# EAGLE design cap_mother_v1.0 (EAGLE 9.5.1)
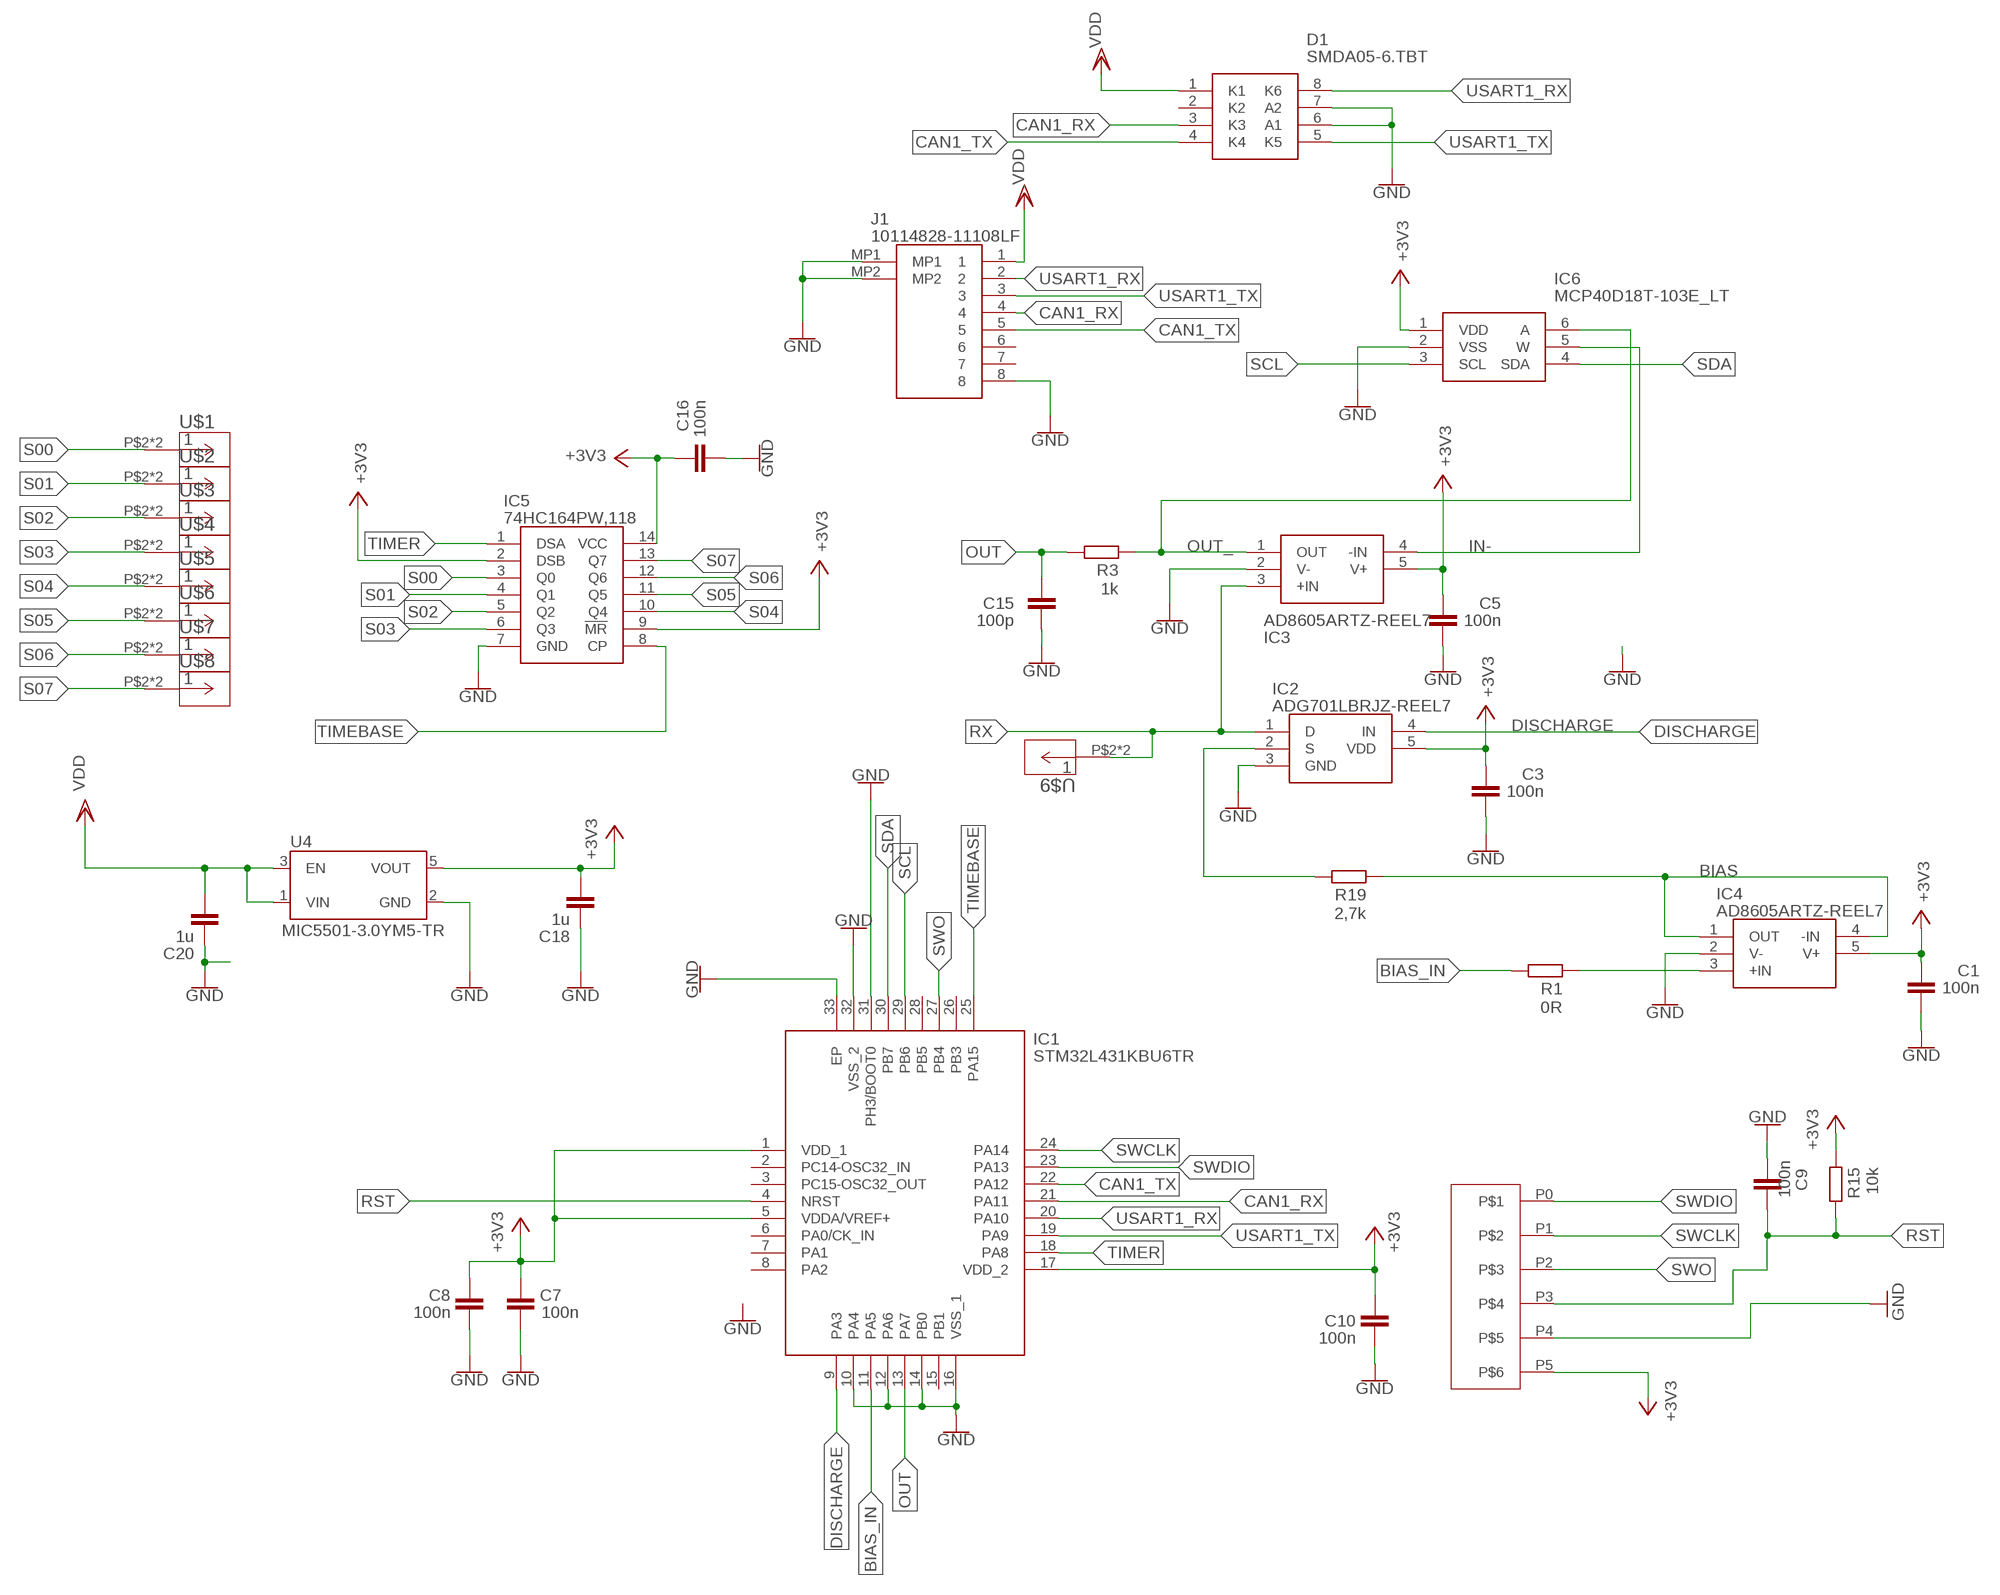
[diagram p0: schematic, sheet 1]

## Parts
C1  100n  C-EUC0603K  [C0603K]
C3  100n  C-EUC0603K  [C0603K]
C5  100n  C-EUC0603K  [C0603K]
C7  100n  C-EUC0603K  [C0603K]
C8  100n  C-EUC0603K  [C0603K]
C9  100n  C-EUC0603  [C0603]
C10  100n  C-EUC0603K  [C0603K]
C15  100p  C-EUC0603  [C0603]
C16  100n  C-EUC0603K  [C0603K]
C18  1u  C-EUC0603K  [C0603K]
C20  1u  C-EUC0603  [C0603]
D1  SMDA05-6.TBT  [SOIC127P600X175-8N]
IC1  STM32L431KBU6TR  [QFN50P500X500X60-33N]
IC2  ADG701LBRJZ-REEL7  [SOT95P280X145-5N]
IC3  AD8605ARTZ-REEL7  [SOT95P280X145-5N]
IC4  AD8605ARTZ-REEL7  [SOT95P280X145-5N]
IC5  74HC164PW,118  [SOP65P640X110-14N]
IC6  MCP40D18T-103E_LT  [SOT65P210X110-6N]
J1  10114828-11108LF  [1011482811108LF]
R1  0R  R-EU_R0603  [R0603]
R3  1k  R-EU_R0603  [R0603]
R15  10k  R-EU_R0603  [R0603]
R19  2,7k  R-EU_R0603  [R0603]
U4  MIC5501-3.0YM5-TR  [SOT95P280X145-5N]
U$1  CAST_HOLE_1X1SHORT  [CASTELATED_HOLE_SHORT]
U$2  CAST_HOLE_1X1SHORT  [CASTELATED_HOLE_SHORT]
U$3  CAST_HOLE_1X1SHORT  [CASTELATED_HOLE_SHORT]
U$4  CAST_HOLE_1X1SHORT  [CASTELATED_HOLE_SHORT]
U$5  CAST_HOLE_1X1SHORT  [CASTELATED_HOLE_SHORT]
U$6  CAST_HOLE_1X1SHORT  [CASTELATED_HOLE_SHORT]
U$7  CAST_HOLE_1X1SHORT  [CASTELATED_HOLE_SHORT]
U$8  CAST_HOLE_1X1SHORT  [CASTELATED_HOLE_SHORT]
U$9  CAST_HOLE_1X1SHORT  [CASTELATED_HOLE_SHORT]
U$10  SMD_SWO  [SWD_SMD]

## Nets
+3V3: C1.2 C3.2 C5.2 C7.2 C8.2 C10.2 C16.2 C18.2 IC1.1(VDD_1) IC1.5(VDDA/VREF+) IC1.17(VDD_2) IC2.5(VDD) IC3.5(V+) IC4.5(V+) IC5.2(DSB) IC5.9(!MR) IC5.14(VCC) IC6.1(VDD) R15.1 U4.5(VOUT) U$10.P5
BIAS: IC4.1(OUT) IC4.4(-IN) R19.1
BIAS_IN: IC1.11(PA5) R1.2
CAN1_RX: D1.3(K3) IC1.21(PA11) J1.4
CAN1_TX: D1.4(K4) IC1.22(PA12) J1.5
DISCHARGE: IC1.9(PA3) IC2.4(IN)
GND: C1.1 C3.1 C5.1 C7.1 C8.1 C9.1 C10.1 C15.1 C16.1 C18.1 C20.1 D1.6(A1) D1.7(A2) IC1.10(PA4) IC1.12(PA6) IC1.14(PB0) IC1.16(VSS_1) IC1.31(PH3/BOOT0) IC1.32(VSS_2) IC1.33(EP) IC2.3(GND) IC3.2(V-) IC4.2(V-) IC5.7(GND) IC6.2(VSS) J1.8 J1.MP1 J1.MP2 U4.2(GND) U$10.P4
IN-: IC3.4(-IN) IC6.5(W)
N$1: IC4.3(+IN) R1.1
OUT: C15.2 IC1.13(PA7) R3.2
OUT_: IC3.1(OUT) IC6.6(A) R3.1
RST: C9.2 IC1.4(NRST) R15.2 U$10.P3
RX [RX]: IC2.1(D) IC3.3(+IN) U$9.P$2 U$9.P$3
S: IC2.2(S) R19.2
S00: IC5.3(Q0) U$1.P$2 U$1.P$3
S01: IC5.4(Q1) U$2.P$2 U$2.P$3
S02: IC5.5(Q2) U$3.P$2 U$3.P$3
S03: IC5.6(Q3) U$4.P$2 U$4.P$3
S04: IC5.10(Q4) U$5.P$2 U$5.P$3
S05: IC5.11(Q5) U$6.P$2 U$6.P$3
S06: IC5.12(Q6) U$7.P$2 U$7.P$3
S07: IC5.13(Q7) U$8.P$2 U$8.P$3
SCL: IC1.29(PB6) IC6.3(SCL)
SDA: IC1.30(PB7) IC6.4(SDA)
SWCLK: IC1.24(PA14) U$10.P1
SWDIO: IC1.23(PA13) U$10.P0
SWO: IC1.27(PB4) U$10.P2
TIMEBASE: IC1.25(PA15) IC5.8(CP)
TIMER: IC1.18(PA8) IC5.1(DSA)
USART1_RX: D1.8(K6) IC1.20(PA10) J1.2
USART1_TX: D1.5(K5) IC1.19(PA9) J1.3
VDD: C20.2 D1.1(K1) J1.1 U4.1(VIN) U4.3(EN)
Unconnected: D1.2(K2) IC1.2(PC14-OSC32_IN) IC1.3(PC15-OSC32_OUT) IC1.6(PA0/CK_IN) IC1.7(PA1) IC1.8(PA2) IC1.15(PB1) IC1.26(PB3) IC1.28(PB5) J1.6 J1.7

## Library data of the parts
C1 C3 C5 C7-C10 C15 C16 C18 C20 = rcl:C-EU: CAPACITOR, European symbol; SPICEPREFIX: C
D1 = SamacSys_Parts:SMDA05-6.TBT: Semtech SMDA05-6.TBT, Hex-Element Uni-Directional TVS Diode Array, 300W, 8-Pin SOIC Source: Datasheet <https://datasheet.datasheetarchive.com/originals/distributors/DKDS-37/728677.pdf>; DESCRIPTION: Semtech SMDA05-6.TBT, Hex-Element Uni-Directional TVS Diode Array, 300W, 8-Pin SOIC; HEIGHT: 1.75mm; MANUFACTURER_NAME: SEMTECH; MANUFACTURER_PART_NUMBER: SMDA05-6.TBT; MOUSER_PART_NUMBER: 947-SMDA05-6.TBT; MOUSER_PRICE-STOCK: https://www.mouser.co.uk/ProductDetail/Semtech/SMDA05-6TBT/?qs=rBWM4%252BvDhIeV9BDKWI3yYQ%3D%3D
IC1 = SamacSys_Parts:STM32L431KBU6TR: ARM Microcontrollers - MCU Ultra-low-power with FPU ARM Cortex-M4 MCU 80 MHz with 128 Kbytes Flash Source: Datasheet <http://www.st.com/content/ccc/resource/technical/document/datasheet/group3/83/b3/60/f6/b1/cc/47/7e/DM00257211/files/DM00257211.pdf/jcr:content/translations/en.DM00257211.pdf>; DESCRIPTION: ARM Microcontrollers - MCU Ultra-low-power with FPU ARM Cortex-M4 MCU 80 MHz with 128 Kbytes Flash; HEIGHT: 0.6mm; MANUFACTURER_NAME: STMicroelectronics; MANUFACTURER_PART_NUMBER: STM32L431KBU6TR; MOUSER_PART_NUMBER: 511-STM32L431KBU6TR; MOUSER_PRICE-STOCK: https://www.mouser.co.uk/ProductDetail/STMicroelectronics/STM32L431KBU6TR?qs=W0yvOO0ixfE2EtLQW2K77Q%3D%3D
IC2 = SamacSys_Parts:ADG701LBRJZ-REEL7: Analog Switch ICs Low Voltage SPDT IC with Low Leakage Source: Datasheet <https://www.analog.com/media/en/technical-documentation/data-sheets/adg701l_702l.pdf>; DESCRIPTION: Analog Switch ICs Low Voltage SPDT IC with Low Leakage; HEIGHT: 1.45mm; MANUFACTURER_NAME: Analog Devices; MANUFACTURER_PART_NUMBER: ADG701LBRJZ-REEL7; MOUSER_PART_NUMBER: 584-ADG701LBRJZ-R7; MOUSER_PRICE-STOCK: https://www.mouser.co.uk/ProductDetail/Analog-Devices/ADG701LBRJZ-REEL7?qs=BpaRKvA4VqGa%2F05Rk2gYkw%3D%3D
IC3 IC4 = SamacSys_Parts:AD8605ARTZ-REEL7: Operational Amplifiers Source: Datasheet; DESCRIPTION: Operational Amplifiers; HEIGHT: 1.45mm; MANUFACTURER_NAME: Analog Devices; MANUFACTURER_PART_NUMBER: AD8605ARTZ-REEL7; MOUSER_PART_NUMBER: 584-AD8605ARTZ-R7; MOUSER_PRICE-STOCK: https://www.mouser.co.uk/ProductDetail/Analog-Devices/AD8605ARTZ-REEL7?qs=%2FtpEQrCGXCy1BQTrX2ofig%3D%3D
IC5 = SamacSys_Parts:74HC164PW,118: 74HC(T)164 - 8-bit serial-in, parallel-out shift register@en-us Source: Datasheet <https://assets.nexperia.com/documents/data-sheet/74HC_HCT164.pdf>; DESCRIPTION: 74HC(T)164 - 8-bit serial-in, parallel-out shift register@en-us; HEIGHT: 1.1mm; MANUFACTURER_NAME: Nexperia; MANUFACTURER_PART_NUMBER: 74HC164PW,118; MOUSER_PART_NUMBER: 771-74HC164PW-T; MOUSER_PRICE-STOCK: https://www.mouser.co.uk/ProductDetail/Nexperia/74HC164PW118?qs=P62ublwmbi9iFqSookzqlw%3D%3D
IC6 = SamacSys_Parts:MCP40D18T-103E_LT: Digital Potentiometer, 10k, 7-bit, I2C Source: Datasheet <http://ww1.microchip.com/downloads/en/DeviceDoc/22152b.pdf>; DESCRIPTION: Digital Potentiometer, 10k, 7-bit, I2C; HEIGHT: 1.1mm; MANUFACTURER_NAME: Microchip; MANUFACTURER_PART_NUMBER: MCP40D18T-103E/LT; MOUSER_PART_NUMBER: 579-MCP40D18T103E/LT; MOUSER_PRICE-STOCK: https://www.mouser.co.uk/ProductDetail/Microchip-Technology/MCP40D18T-103E-LT?qs=dQMF8gqycOXln2h%252BoShOLQ%3D%3D
J1 = SamacSys_Parts:10114828-11108LF: 1.25mm Wire to Board Wafer,Vertical, Surface Mount, 8 Positions Source: Datasheet <https://cdn.amphenol-cs.com/media/wysiwyg/files/drawing/10114828.pdf>; DESCRIPTION: 1.25mm Wire to Board Wafer,Vertical, Surface Mount, 8 Positions; HEIGHT: 5.2mm; MANUFACTURER_NAME: Amphenol Communications Solutions; MANUFACTURER_PART_NUMBER: 10114828-11108LF; MOUSER_PART_NUMBER: 649-10114828-11108LF; MOUSER_PRICE-STOCK: https://www.mouser.co.uk/ProductDetail/Amphenol-FCI/10114828-11108LF?qs=SqJKR5MmryfFoElmUQ%252BV5w%3D%3D
R1 R3 R15 R19 = rcl:R-EU_: RESISTOR, European symbol; SPICEPREFIX: R
U4 = LDO:MIC5501-3.0YM5-TR: General Purpose Single 300mA LDO, 5 SOT-23 T/R Check prices <https://pricing.snapeda.com/parts/MIC5501-3.0YM5-TR/Microchip/view-part?ref=eda>; AVAILABILITY: In Stock; DESCRIPTION: Linear Voltage Regulator IC Positive Fixed 1 Output 300mA SOT-23-5; MF: Microchip; MP: MIC5501-3.0YM5-TR; PACKAGE: SOT-23 Microchip; PRICE: None; PURCHASE-URL: https://pricing.snapeda.com/search/part/MIC5501-3.0YM5-TR/?ref=eda
U$1-U$9 = connectors:CAST_HOLE_1X1
U$10 = connectors:SMD_SWO

## Net classes
0 default: width 0.152 mm, clearance 0.203 mm
2 distance: width 0.152 mm, clearance 0.4 mm
3 RX: clearance 0.8 mm to class 0, clearance 0.8 mm
4 VDD: width 0.4 mm, clearance 0.3 mm to class 0, clearance 2 mm to class 3, clearance 0.3 mm

## Board
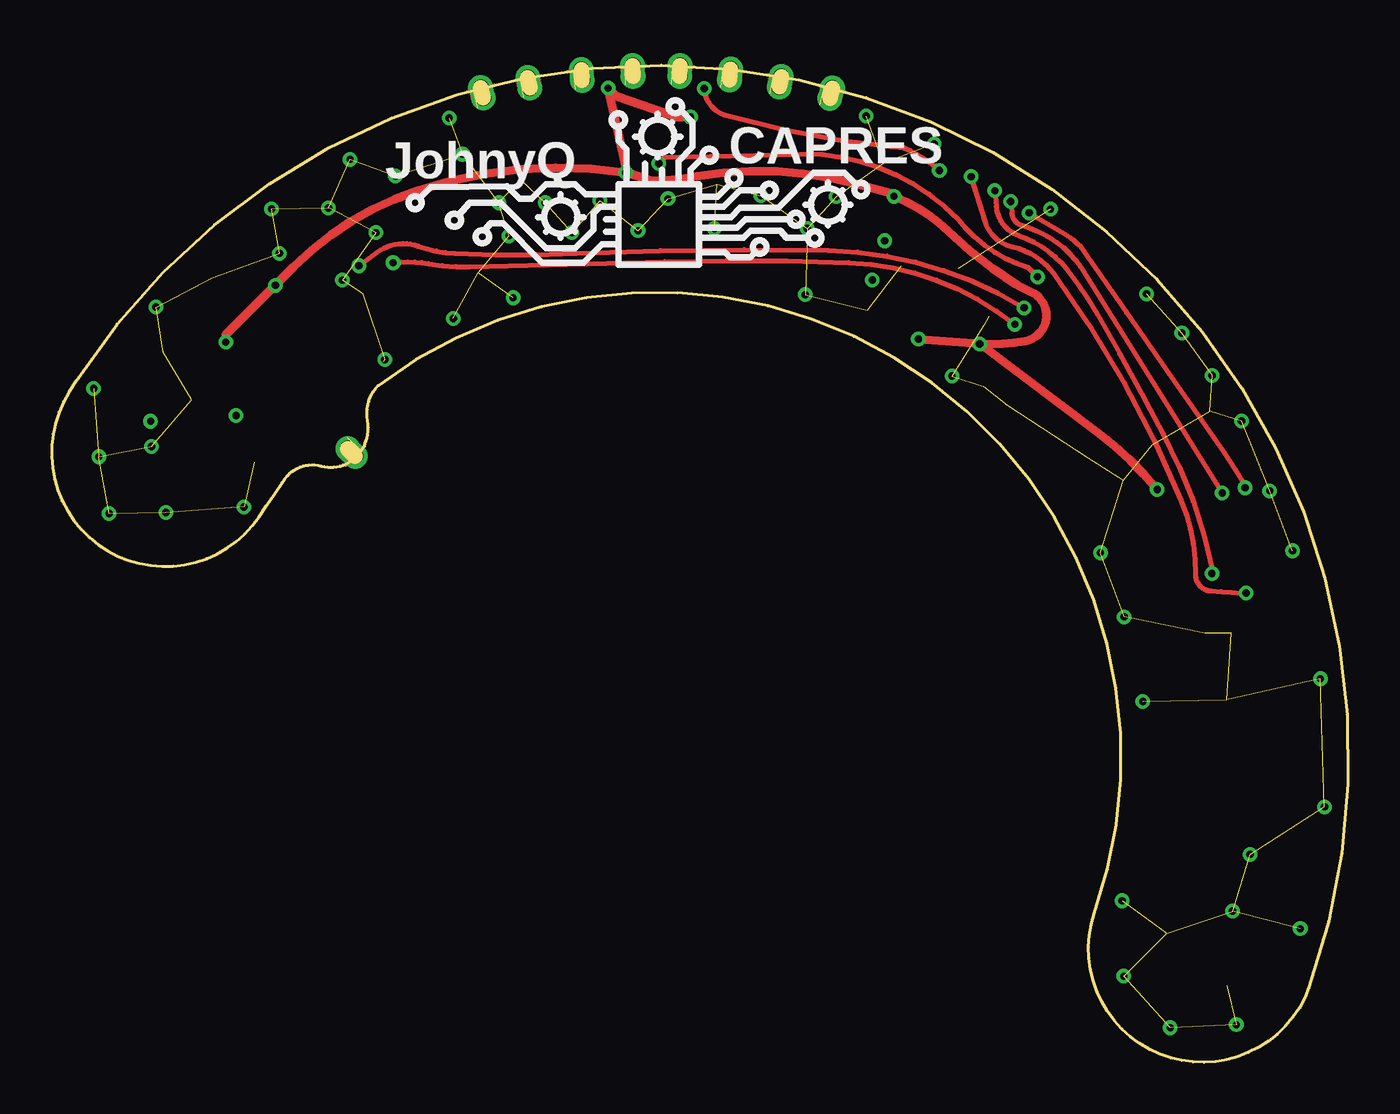
[diagram p1: board, top side]
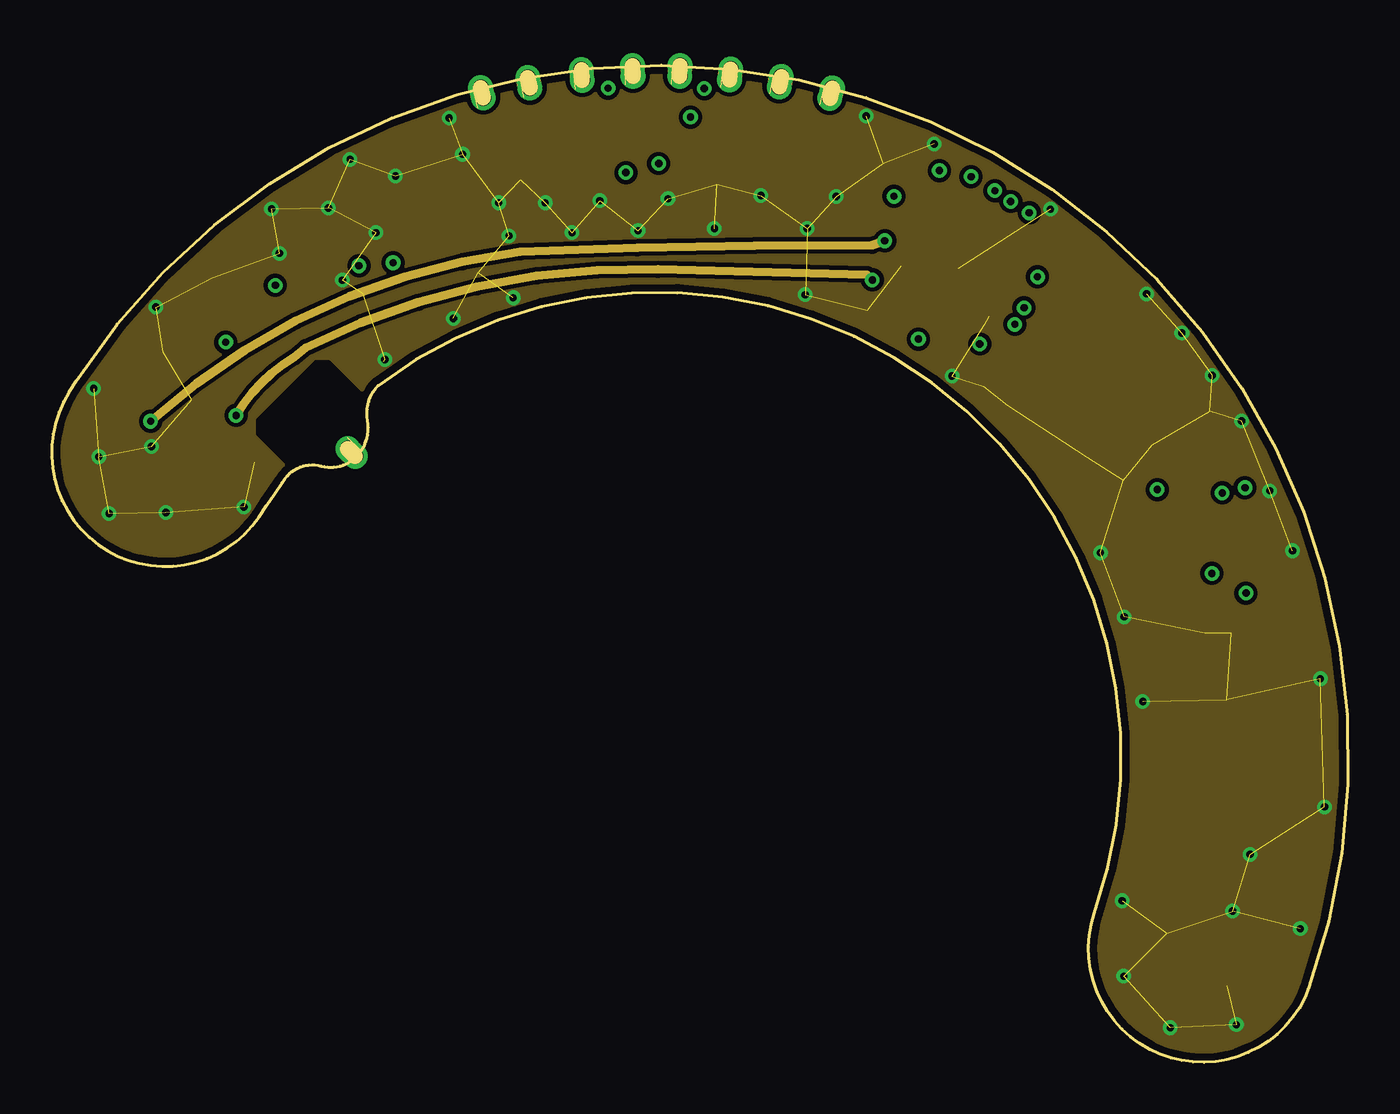
[diagram p2: board, inner layer Route2]
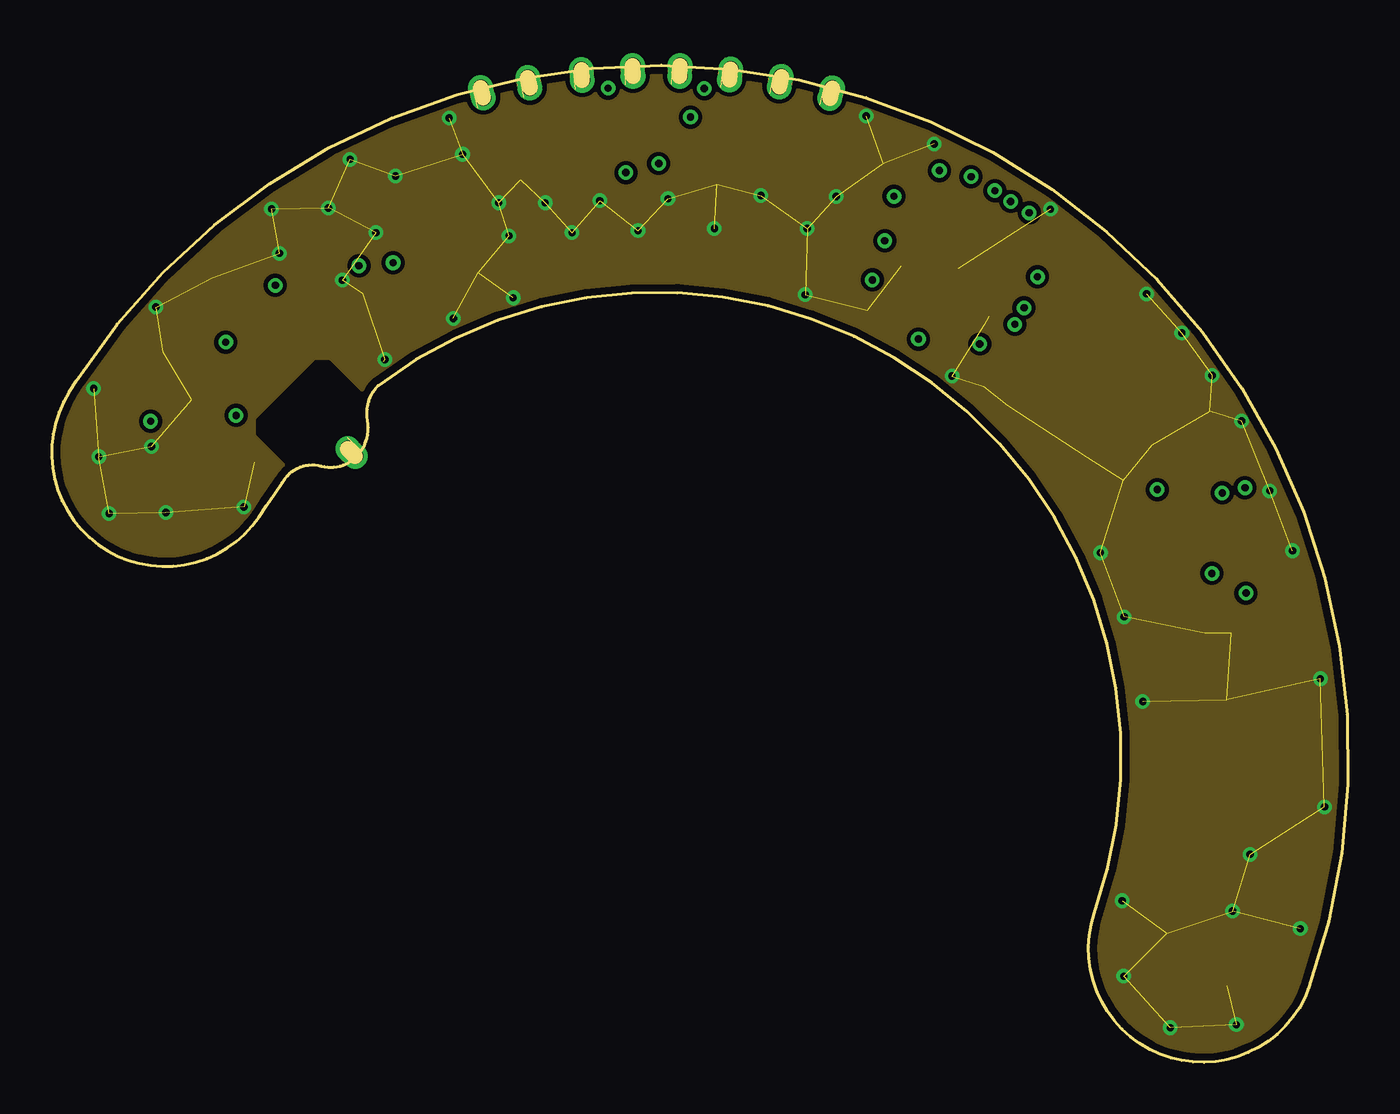
[diagram p3: board, inner layer Route15]
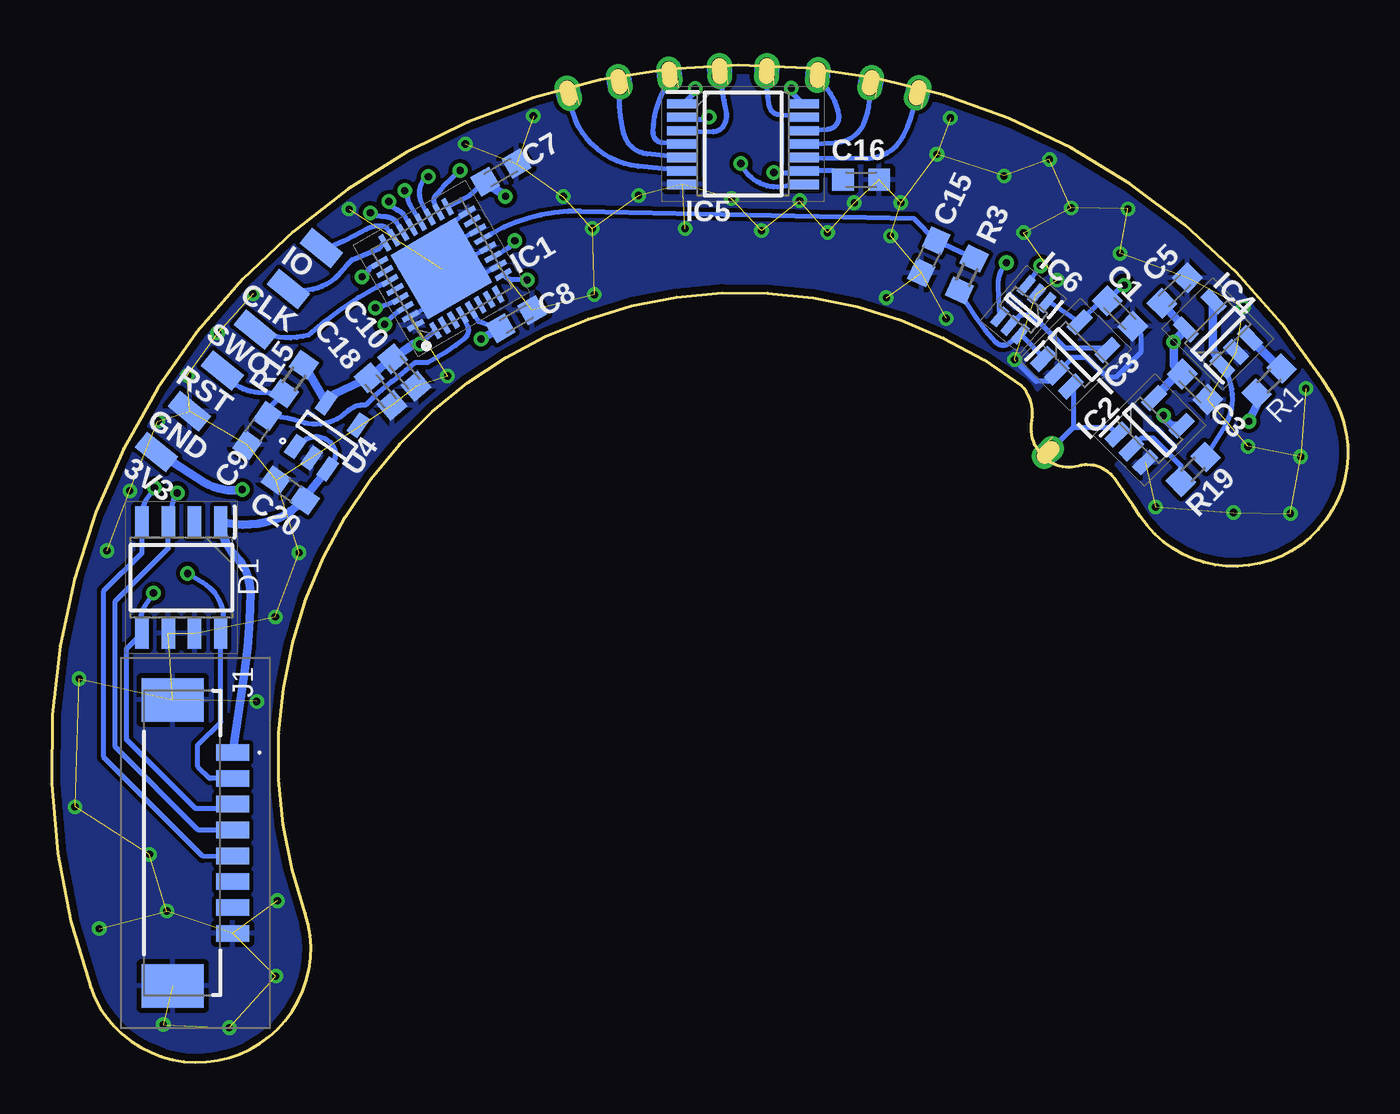
[diagram p4: board, bottom side, seen from below]

Size 62.79 x 48.28 mm. Coordinates in mm from the lower left corner, seen from the top.
Outline: 11.16,28.07 11.31,28.27 arc-68 13.06,28.87 arc60 14.76,29.32 arc55 15.31,31.07 arc-53 15.81,32.77 arc-146 50.51,7.22 arc178 60.91,3.62 arc166 1.21,33.02 0.86,32.47 arc178 10.06,26.42 arc1 11.16,28.07
Copper layers (1+2*15+16): Top 0.035559375mm / dielectric 0.47751875mm / Route2 0.035559375mm / dielectric 0.47751875mm / Route15 0.035559375mm / dielectric 0.47751875mm / Bottom 0.035559375mm
Design rules "SparkFun-4-Layer-General-JLCPCB *": minimum track width 7mil, minimum drill 12mil, track to track 0.2mm, track to pad 0.2mm, pad to pad 0.15mm, via to via 0.2mm, smd to smd 0.15mm, copper to edge 0.35mm, drill to drill 7mil, minimum pad ring 7mil, minimum via ring 7mil, stop-mask expansion 3mil, vias tented up to drill 25mil, thermal gap 10mil

### Footprints (pad centres in the part's own frame; a part is rotated, then mirrored left to right if it is on the bottom)
C0603K = smd 1.05 x 1.08: 1 -0.875,0; 2 0.875,0
C0603 = smd 1.1 x 1: 1 -0.85,0; 2 0.85,0
SOIC127P600X175-8N = smd 1.5 x 0.65: 1 -2.7,1.905; 2 -2.7,0.635; 3 -2.7,-0.635; 4 -2.7,-1.905; 5 2.7,-1.905; 6 2.7,-0.635; 7 2.7,0.635; 8 2.7,1.905
QFN50P500X500X60-33N = smd 0.85 x 0.25: 1 -2.45,1.75; 2 -2.45,1.25; 3 -2.45,0.75; 4 -2.45,0.25; 5 -2.45,-0.25; 6 -2.45,-0.75; 7 -2.45,-1.25; 8 -2.45,-1.75; 17 2.45,-1.75; 18 2.45,-1.25; 19 2.45,-0.75; 20 2.45,-0.25; 21 2.45,0.25; 22 2.45,0.75; 23 2.45,1.25; 24 2.45,1.75 | smd 0.25 x 0.85: 9 -1.75,-2.45; 10 -1.25,-2.45; 11 -0.75,-2.45; 12 -0.25,-2.45; 13 0.25,-2.45; 14 0.75,-2.45; 15 1.25,-2.45; 16 1.75,-2.45; 25 1.75,2.45; 26 1.25,2.45; 27 0.75,2.45; 28 0.25,2.45; 29 -0.25,2.45; 30 -0.75,2.45; 31 -1.25,2.45; 32 -1.75,2.45 | smd 3.6 x 3.6: 33 0,0
SOT95P280X145-5N = smd 1.2 x 0.6: 1 -1.25,0.95; 2 -1.25,0; 3 -1.25,-0.95; 4 1.25,-0.95; 5 1.25,0.95
SOP65P640X110-14N = smd 1.475 x 0.45: 1 -2.938,1.95; 2 -2.938,1.3; 3 -2.938,0.65; 4 -2.938,0; 5 -2.938,-0.65; 6 -2.938,-1.3; 7 -2.938,-1.95; 8 2.938,-1.95; 9 2.938,-1.3; 10 2.938,-0.65; 11 2.938,0; 12 2.938,0.65; 13 2.938,1.3; 14 2.938,1.95
SOT65P210X110-6N = smd 1 x 0.4: 1 -1,0.65; 2 -1,0; 3 -1,-0.65; 4 1,-0.65; 5 1,0; 6 1,0.65
1011482811108LF = smd 0.8 x 1.6: 1 -4.375,2.15; 2 -3.125,2.15; 3 -1.875,2.15; 4 -0.625,2.15; 5 0.625,2.15; 6 1.875,2.15; 7 3.125,2.15; 8 4.375,2.15 | smd 2.1 x 3: MP1 -6.925,-0.75; MP2 6.925,-0.75
R0603 = smd 1 x 1.1: 1 -0.85,0; 2 0.85,0
SOT95P280X145-5N' = smd 1.1 x 0.6: 1 -1.3,0.95; 2 -1.3,0; 3 -1.3,-0.95; 4 1.3,-0.95; 5 1.3,0.95
CASTELATED_HOLE_SHORT = drill 0.75 pad 1.2: P$2 0,-1.1; P$3 0,-1.61
SWD_SMD = smd 1.93 x 0.965: P0 0,0; P1 0,-2.54; P2 0,-5.08; P3 0,-7.62; P4 0,-10.16; P5 0,-12.7

### Placement (x,y rotation side)
C1  11.04,36.26 135 bottom
C3  7.41,32.71 135 bottom
C5  8.39,37.37 225 bottom
C7  41.03,43.08 210 bottom
C8  40.28,35.98 210 bottom
C9  52.83,30.59 55 bottom
C10  45.71,33.41 130 bottom
C15  20.3,39.01 65 bottom
C16  23.58,42.73 180 bottom
C18  46.86,32.48 130 bottom
C20  51.23,27.7 325 bottom
D1  56.51,23.47 270 bottom
IC1  43.91,38.43 120 bottom
IC2  9.61,30.61 45 bottom
IC3  13.21,34.28 45 bottom
IC4  6.3,35.28 135 bottom
IC5  29.3,44.46 0 bottom
IC6  15.73,36.44 230 bottom
J1  56.18,10.62 270 bottom
R1  3.82,32.99 225 bottom
R3  18.46,38.15 65 bottom
R15  51.06,33.08 235 bottom
R19  7.49,28.72 225 bottom
U4  MIC5501-3.0YM5-TR  [SOT95P280X145-5N']  49.46,30.33 55 bottom
U$1  30.48,49.36 358.2 top
U$2  33.02,49.18 353.5 top
U$3  35.56,48.81 349 top
U$4  38.1,48.24 345.5 top
U$5  20.51,48.26 14.5 top
U$6  22.86,48.76 11 top
U$7  25.56,49.16 5.3 top
U$8  28.11,49.36 1.8 top
U$9  15.49,28.57 225 top
U$10  49.72,39.42 321 bottom

### Tracks (layer width: path | path; a pad name or v marks a point on that pad's centre or on a via)
+3V3  (via drill 0.35)
  Top 0.406: v8.44,34.87 8.44,35.22 v10.84,37.62 11.73,38.51 11.72,38.53 arc-26 17.73,42.21 arc-27 v27.82,43.08 | v30.95,45.77 30.3,45.77 27.36,46.77 v26.96,47.17 27.82,43.31 v27.82,43.08 | v27.82,43.08 27.91,43.08 29.03,42.68 arc8 31.27,42.9 arc-25 38.96,42.54 40.65,42.09 v40.81,41.93 arc-22 43.46,40.22 arc12 46.71,37.68 arc10 47.41,37.32 arc-147 47.16,34.92 arc-14 v44.96,34.78 | v44.96,34.78 50.75,30.45 arc-14 v53.56,27.73 | v41.99,35.02 v44.96,34.78
  Bottom 0.254: v10.84,37.62 10.91,37.62 C1.2 11.95,36.88 IC3.5 14.4,36.79 IC6.1 | C8.2 41.26,35.55 42.11,35.87 IC1.5 | C7.2 42.55,41.96 IC1.17 | IC1.1 v44.96,34.78 | C16.2 24.89,43.16 IC5.9 26.44,43.08 v27.82,43.08 | IC5.14 26.41,46.41 26.96,46.96 v26.96,47.17 | IC5.2 32.15,45.67 31.05,45.67 v30.95,45.77
  Bottom 0.406: 41.65,42.51 C7.2 v40.81,41.93 | IC2.5 8.23,33.33 C3.2 8.44,33.74 v8.44,34.87 8.44,34.91 IC4.5 C5.2 | U$10.P5 55.38,28.08 arc-41 v53.56,27.73 | C8.2 41.68,35.22 arc-9 v41.99,35.02 | R15.1 U4.5 49.07,32.37 C18.2 46.34,34.08 C10.2 45.23,34.78 v44.96,34.78
  cutout Route2: 29.31,36.77 arc90 7.31,14.77 arc90 29.31,-7.23 arc90 51.31,14.77 arc90
BIAS
  Bottom 0.254: 6.89,29.27 R19.1 6.01,30.7 arc-68 IC4.1
  Bottom 0.406: IC4.1 6.54,34.47 6.54,36.81 IC4.4
BIAS_IN  (via drill 0.35)
  Route2 0.406: v40.36,39.78 39.74,39.55 arc3 22.7,39.24 arc35 v4.8,31.04
  Bottom 0.254: 41.36,39.06 IC1.11 40.86,39.32 arc-26 v40.36,39.78
  Bottom 0.406: v4.8,31.04 4.42,31.84 R1.2
CAN1_RX  (via drill 0.35)
  Top 0.254: v46.46,41.68 46.51,41.13 arc68 47.01,40.52 arc-15 48.36,39.92 arc-23 49.86,38.52 v56.71,27.57
  Bottom 0.254: IC1.21 45.66,40.93 arc-35 46.06,41.28 arc42 v46.46,41.68 | J1.4 55.68,11.25 59.71,15.27 59.71,22.32 57.14,24.89 D1.3 56.91,27.12 arc13 56.76,27.52 arc36 v56.71,27.57
CAN1_TX  (via drill 0.35)
  Top 0.254: v47.36,41.13 47.43,41.06 49.21,40.02 arc-25 50.01,39.28 arc1 56.26,30.32 arc-4 57.86,27.87 arc-152 v57.81,27.82
  Bottom 0.254: IC1.22 46.06,40.63 arc-55 46.56,40.93 arc10 47.26,41.03 arc64 v47.36,41.13 | J1.5 55.47,9.99 60.26,14.77 60.26,22.82 58.41,24.67 D1.4 arc45 58.16,27.32 v57.81,27.82
DISCHARGE  (via drill 0.35)
  Route2 0.406: v39.76,37.88 39.5,38.14 29.37,38.4 arc28 12.3,34.61 11.76,34.14 arc29 v8.94,31.32
  Bottom 0.254: v39.76,37.88 40.5,37.88 40.76,37.99 IC1.9
  Bottom 0.406: IC2.4 8.54,30.82 8.94,31.22 v8.94,31.32
GND  (via drill 0.35)  (76 unrouted)
  Bottom 0.254: C1.1 10.04,35.26 10.04,34.37 11.24,33.17 11.69,33.17 12.64,34.12 13.36,34.12 IC3.2 14.51,32.97 15.11,32.97 16.09,33.95 | 44,38.01 IC1.33 | IC1.31 43.91,36.98 arc-120 IC1.33 | IC1.10 42.16,37.98 arc90 IC1.33 | IC1.14 43.46,39.53 arc-74 IC1.33 | IC1.12 42.61,38.88 arc23 IC1.33 | IC1.16 43.21,40.78 arc-76 IC1.33
  other vias: 14.09,37.87 9.32,26.89 43.62,33.23 16.15,34.03 11.04,39.17 2.04,32.62 4.84,29.82 57.65,31.05 56.22,33.26 54.75,35.31 53.04,37.21 21.66,41.62 23.91,41.62 26.56,41.72 29.86,41.82 34.36,41.97 38.01,41.92 22.16,40.02 25.21,40.17 32.11,40.37 36.61,40.37 28.41,40.27 15.71,40.17 13.41,41.37 16.66,42.92 19.91,43.97 36.51,37.17 22.36,37.02 50.81,24.67 59.01,27.67 60.11,24.77 51.96,21.57 52.86,17.47 51.86,7.82 57.21,7.32 58.06,10.07 61.46,18.57 61.66,12.37 39.46,45.82 42.76,44.47 19.26,45.72 14.46,43.72 10.66,41.32 5.06,36.57 19.46,36.02 2.29,29.32 5.54,26.62 2.79,26.57 60.49,6.47 57.39,1.82 51.94,4.17 54.19,1.67 48.39,41.31
  pour Bottom: 29.31,48.27 arc90 -4.19,14.77 arc90 29.31,-18.73 arc90 62.81,14.77 arc90
  cutout Bottom: 29.31,36.77 arc90 7.31,14.77 arc90 29.31,-7.23 arc90 51.31,14.77 arc90
  pour Route15: 29.31,48.27 arc90 -4.19,14.77 arc90 29.31,-18.73 arc90 62.81,14.77 arc90
  cutout Route15: 29.31,36.77 arc90 7.31,14.77 arc90 29.31,-7.23 arc90 51.31,14.77 arc90
  pour Route2: 29.31,48.27 arc90 -4.19,14.77 arc90 29.31,-18.73 arc90 62.81,14.77 arc90
  cutout Top: 11.76,28.67 10.01,30.42 10.01,31.12 12.81,33.92 13.41,33.92 16.71,30.62 16.71,29.97 13.91,27.17 13.31,27.17 13.26,27.17
  cutout Bottom: 11.76,28.67 10.01,30.42 10.01,31.12 12.81,33.92 13.41,33.92 16.71,30.62 16.71,29.97 13.91,27.17 13.31,27.17 13.26,27.17
  cutout Route15: 11.76,28.67 10.01,30.42 10.01,31.12 12.81,33.92 13.41,33.92 16.71,30.62 16.71,29.97 13.91,27.17 13.31,27.17 13.26,27.17
  cutout Route2: 11.76,28.67 10.01,30.42 10.01,31.12 12.81,33.92 13.41,33.92 16.71,30.62 16.71,29.97 13.91,27.17 13.31,27.17 13.26,27.17
IN-
  Bottom 0.254: IC3.4 11.78,34.61 13.72,34.61 15.28,36.17 15.87,36.17 IC6.5
  Bottom 0.406: 11.75,34.59 IC3.4
N$1
  Bottom 0.406: IC4.3 3.27,33.59 R1.1
OUT
  Bottom 0.254: 41.88,39.9 IC1.13 41.46,40.13 arc31 37.16,41.21 21.03,40.86 C15.2 R3.2
OUT_
  Bottom 0.254: 15.02,34.06 IC3.1 14.76,34.15 IC6.6 16.41,34.82 arc87 17.06,34.87 arc14 R3.1
RST
  Bottom 0.254: IC1.4 42.66,35.68 arc76 42.8,35.04 arc12 44.57,33.88 45.18,33.88 45.2,33.86 46.24,32.99 46.3,32.99 46.35,32.93 47.1,32.31 47.54,31.86 arc43 47.66,31.82 arc-47 48.46,31.52 arc63 50.76,31.02 arc-20 C9.2 52.34,31.59 R15.2 52.77,32.43 arc57 U$10.P3
RX  (1 unrouted)
  Bottom 0.254: IC3.3 13.31,32.61 13.31,30.75 | U$9.P$2 13.31,30.75 | 13.31,30.75 11.51,30.75 IC2.1
S
  Bottom 0.254: R19.2 8.09,28.89 9.43,30.22 9.99,30.22 IC2.2
S00  (1 unrouted)
  Bottom 0.254: U$1.P$3 30.4,47.73 arc-2 30.11,46.02 arc46 30.26,45.32 arc57 30.77,45.07 IC5.3
S01  (1 unrouted)
  Bottom 0.254: IC5.4 33.21,44.53 arc87 33.66,45.02 arc34 U$2.P$3
S02  (1 unrouted)
  Bottom 0.254: 35.52,47 arc29 U$3.P$3 arc-22 35.06,44.92 arc-68 33.94,43.99 IC5.5
S03  (1 unrouted)
  Bottom 0.254: IC5.6 34.37,43.39 arc78 U$4.P$3
S04  (1 unrouted)
  Bottom 0.254: IC5.10 23.38,43.77 arc-62 21.55,44.84 arc-18 U$5.P$3
S05  (1 unrouted)
  Bottom 0.254: IC5.11 24.84,44.53 arc-59 23.47,45.39 arc-28 U$6.P$3
S06  (1 unrouted)
  Bottom 0.254: U$7.P$3 25.69,47.54 arc46 24.66,45.87 arc95 25.22,45.18 IC5.12
S07  (1 unrouted)
  Bottom 0.254: 27.89,47.49 arc17 U$8.P$3 arc-11 28.01,46.27 arc-73 27.58,45.89 IC5.13
SCL  (via drill 0.35)
  Top 0.254: v14.89,38.57 15.76,39.22 arc-56 17.76,39.52 arc17 19.54,39.17 arc5 25.41,39.17 arc-4 37.63,39.32 arc-30 v47.11,36.53
  Bottom 0.254: IC6.3 15.51,37.7 v14.89,38.57 | IC1.29 46.35,36.78 arc16 v47.11,36.53
SDA  (via drill 0.35)
  Top 0.254: v16.54,38.72 16.92,38.74 arc-14 18.26,38.67 arc11 20.26,38.52 29.71,38.77 arc-4 38.61,38.72 arc-36 v46.66,35.73
  Bottom 0.254: IC1.30 45.82,36.46 arc-19 v46.66,35.73 | IC6.4 16.94,37.52 arc43 v16.54,38.72
SWCLK
  Bottom 0.254: IC1.24 arc-45 46.9,39.42 48.24,38.87 arc-8 48.9,38.1 arc59 U$10.P1
SWDIO
  Bottom 0.254: IC1.23 46.51,40.33 arc-46 46.76,40.48 arc-37 47.56,40.33 arc5 49.2,39.51 arc-39 U$10.P0
SWO
  Bottom 0.254: IC1.27 47.05,37.52 arc-15 50.33,35.22 arc43 U$10.P2
TIMEBASE  (via drill 0.35)
  Top 0.254: v47.76,38.03 47.32,38.47 arc-35 43.92,40.83 arc40 37.33,43.96 29.69,43.8 arc13 v29.41,43.52
  Bottom 0.254: IC1.25 46.92,38.71 47.39,38.47 47.41,38.38 v47.76,38.03 | IC5.8 27.46,42.39 arc72 v29.41,43.52
TIMER  (via drill 0.35)
  Top 0.254: 43.01,43.23 arc-157 v43.01,43.18 42.8,43.36 arc18 41.29,44.26 arc-11 32.68,45.84 arc-70 v31.62,47.15
  Bottom 0.254: v43.01,43.18 43.81,42.43 arc10 44.21,41.93 arc-68 44.26,41.63 IC1.18 | IC5.1 32.18,46.41 31.62,46.97 v31.62,47.15
USART1_RX  (via drill 0.35)
  Top 0.254: v45.69,42.21 45.76,41.43 arc66 46.86,40.03 arc-33 49.16,38.42 arc-9 50.66,36.22 arc-2 53.86,30.42 arc-16 56.26,23.72 arc-113 v56.21,23.67
  Bottom 0.254: IC1.20 45.41,41.48 arc42 45.53,42.16 arc-167 v45.69,42.21 | J1.2 55.13,13.75 55.71,14.32 55.71,15.37 54.6,16.48 D1.8 arc-80 55.46,23.22 v56.21,23.67
USART1_TX  (via drill 0.35)
  Top 0.254: v44.54,42.89 45.21,40.73 arc60 46.55,39.49 arc-41 48.56,38.17 arc-14 54.71,27.22 arc-23 55.41,23.62 arc87 56.16,22.82 arc-1 57.66,22.72 arc8 v57.86,22.72
  Bottom 0.254: IC1.19 44.81,41.48 arc73 44.66,42.88 arc88 v44.54,42.89 | 54.03,12.74 J1.3 54.23,12.3 55.83,12.3 59.16,15.62 59.16,20.03 D1.5 arc54 58.26,22.12 v57.86,22.72
VDD
  Bottom 0.254: 49.21,28.94 49.27,28.88 | 49.27,28.88 U4.3 | U4.1 50.54,30.12 arc89 49.2,29.9 arc14 49.11,29.72 arc66 49.27,28.88
  Bottom 0.406: U4.3 50.53,27.34 C20.2 51.16,26.72 arc16 51.76,26.37 arc37 D1.1 arc-40 53.86,24.47 arc44 53.16,22.72 arc8 53.46,18.77 J1.1

### Text on the board
tPlace: JohnyQ | CAPRES
bPlace: IO | CLK | SWO | RST | GND | 3V3